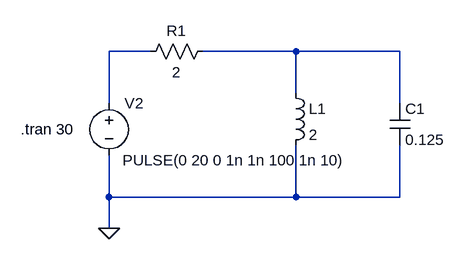
[diagram p0: schematic EXPT_1_PART_2A.asc]
EXPT_1_PART_2A.asc, the LTspice schematic file:
Version 4
SHEET 1 880 680
WIRE 64 48 0 48
WIRE 288 48 144 48
WIRE 448 48 288 48
WIRE 288 112 288 48
WIRE 0 128 0 48
WIRE 448 128 448 48
WIRE 0 272 0 208
WIRE 288 272 288 192
WIRE 288 272 0 272
WIRE 448 272 448 192
WIRE 448 272 288 272
WIRE 0 320 0 272
FLAG 0 320 0
SYMBOL res 160 32 R90
WINDOW 0 0 56 VBottom 2
WINDOW 3 32 56 VTop 2
SYMATTR InstName R1
SYMATTR Value 2
SYMBOL cap 432 128 R0
SYMATTR InstName C1
SYMATTR Value 0.125
SYMBOL ind 272 96 R0
SYMATTR InstName L1
SYMATTR Value 2
SYMBOL voltage 0 112 R0
WINDOW 3 21 103 Left 2
WINDOW 123 24 124 Left 2
WINDOW 39 0 0 Left 0
SYMATTR Value PULSE(0 20 0 1n 1n 100 1n 10)
SYMATTR InstName V2
TEXT -136 168 Left 2 !.tran 30

The netlist it stands for:
* EXPT_1_PART_2A.asc
R1 N002 N001 2
C1 N002 0 0.125
L1 N002 0 2
V2 N001 0 PULSE(0 20 0 1n 1n 100 1n 10)
.tran 30
.backanno
.end